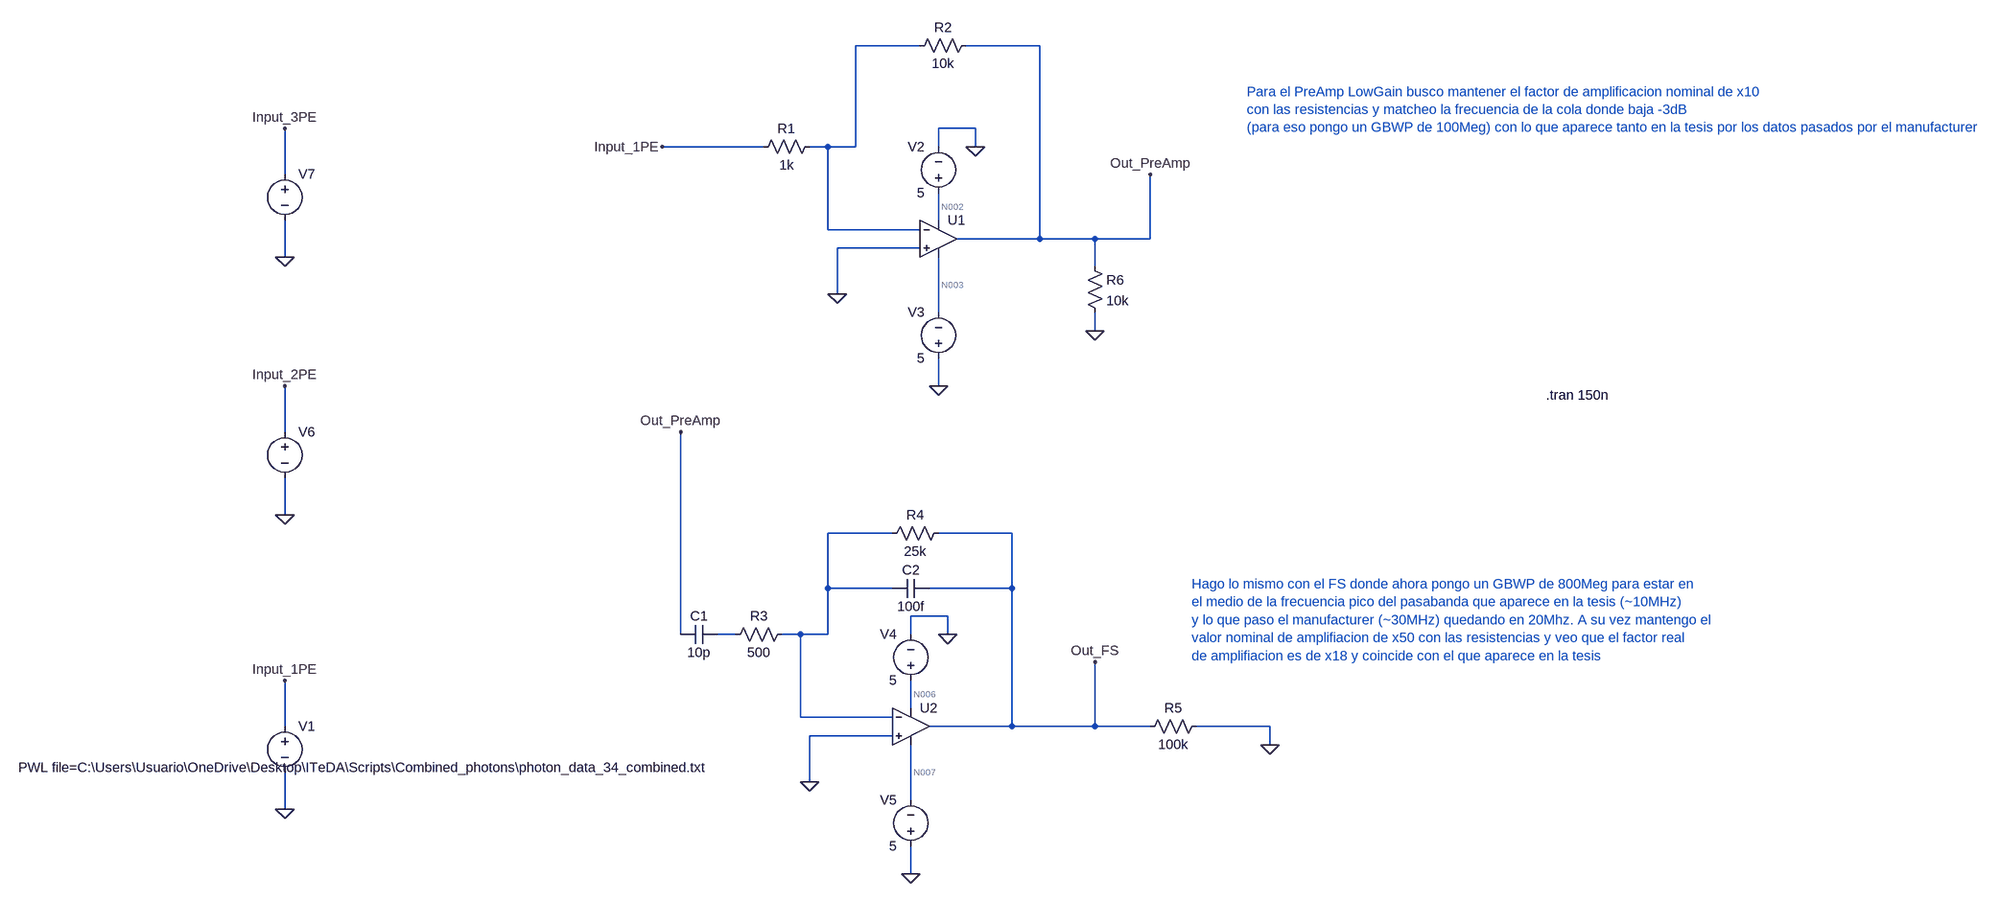
[diagram p0: schematic full_electronic_v4_con_comentariso_ajustadocondata.asc]
full_electronic_v4_con_comentariso_ajustadocondata.asc, the LTspice schematic file:
Version 4
SHEET 1 2316 820
WIRE 144 -800 32 -800
WIRE 352 -800 224 -800
WIRE 240 -656 176 -656
WIRE -128 -624 -304 -624
WIRE -16 -624 -48 -624
WIRE 32 -624 32 -800
WIRE 32 -624 -16 -624
WIRE 176 -624 176 -656
WIRE 240 -624 240 -656
WIRE -960 -576 -960 -656
WIRE 176 -496 176 -544
WIRE -16 -480 -16 -624
WIRE 144 -480 -16 -480
WIRE 352 -464 352 -800
WIRE 352 -464 208 -464
WIRE 448 -464 352 -464
WIRE 544 -464 544 -576
WIRE 544 -464 448 -464
WIRE 144 -448 0 -448
WIRE -960 -432 -960 -496
WIRE 448 -416 448 -464
WIRE 0 -368 0 -448
WIRE 176 -336 176 -432
WIRE 448 -304 448 -336
WIRE 176 -208 176 -256
WIRE -960 -128 -960 -208
WIRE -960 16 -960 -48
WIRE 96 48 -16 48
WIRE 304 48 176 48
WIRE -16 144 -16 48
WIRE 96 144 -16 144
WIRE 304 144 304 48
WIRE 304 144 160 144
WIRE 192 192 128 192
WIRE -272 224 -272 -128
WIRE -176 224 -208 224
WIRE -64 224 -96 224
WIRE -16 224 -16 144
WIRE -16 224 -64 224
WIRE 128 224 128 192
WIRE 192 224 192 192
WIRE 128 352 128 304
WIRE -64 368 -64 224
WIRE 96 368 -64 368
WIRE -960 384 -960 304
WIRE 304 384 304 144
WIRE 304 384 160 384
WIRE 448 384 448 272
WIRE 448 384 304 384
WIRE 544 384 448 384
WIRE 752 384 624 384
WIRE 96 400 -48 400
WIRE 752 416 752 384
WIRE -48 480 -48 400
WIRE 128 512 128 416
WIRE -960 528 -960 464
WIRE 128 640 128 592
FLAG 176 -208 0
FLAG 240 -624 0
FLAG -960 528 0
FLAG 0 -368 0
FLAG 128 640 0
FLAG 192 224 0
FLAG -48 480 0
FLAG 544 -576 Out_PreAmp
FLAG 448 272 Out_FS
FLAG 752 416 0
FLAG -272 -128 Out_PreAmp
FLAG -960 304 Input_1PE
FLAG -960 16 0
FLAG -960 -208 Input_2PE
FLAG -304 -624 Input_1PE
FLAG 448 -304 0
FLAG -960 -432 0
FLAG -960 -656 Input_3PE
SYMBOL res -32 -640 R90
WINDOW 0 0 56 VBottom 2
WINDOW 3 32 56 VTop 2
SYMATTR InstName R1
SYMATTR Value 1k
SYMBOL res 240 -816 R90
WINDOW 0 0 56 VBottom 2
WINDOW 3 32 56 VTop 2
SYMATTR InstName R2
SYMATTR Value 10k
SYMBOL voltage 176 -528 R180
WINDOW 0 24 96 Left 2
WINDOW 3 24 16 Left 2
WINDOW 123 0 0 Left 0
WINDOW 39 0 0 Left 0
SYMATTR InstName V2
SYMATTR Value 5
SYMBOL voltage 176 -240 R180
WINDOW 0 24 96 Left 2
WINDOW 3 24 16 Left 2
WINDOW 123 0 0 Left 0
WINDOW 39 0 0 Left 0
SYMATTR InstName V3
SYMATTR Value 5
SYMBOL OpAmps\\UniversalOpAmp1 176 -464 R0
SYMATTR InstName U1
SYMATTR Value2 Avol=1Meg GBW=100Meg Vos=0
SYMBOL res -80 208 R90
WINDOW 0 0 56 VBottom 2
WINDOW 3 32 56 VTop 2
SYMATTR InstName R3
SYMATTR Value 500
SYMBOL res 192 32 R90
WINDOW 0 0 56 VBottom 2
WINDOW 3 32 56 VTop 2
SYMATTR InstName R4
SYMATTR Value 25k
SYMBOL voltage 128 320 R180
WINDOW 0 24 96 Left 2
WINDOW 3 24 16 Left 2
WINDOW 123 0 0 Left 0
WINDOW 39 0 0 Left 0
SYMATTR InstName V4
SYMATTR Value 5
SYMBOL voltage 128 608 R180
WINDOW 0 24 96 Left 2
WINDOW 3 24 16 Left 2
WINDOW 123 0 0 Left 0
WINDOW 39 0 0 Left 0
SYMATTR InstName V5
SYMATTR Value 5
SYMBOL OpAmps\\UniversalOpAmp1 128 384 R0
SYMATTR InstName U2
SYMATTR Value2 Avol=1Meg GBW=800Meg Vos=0
SYMBOL voltage -960 368 R0
WINDOW 3 -463 87 Left 2
WINDOW 123 0 0 Left 0
WINDOW 39 0 0 Left 0
SYMATTR Value PWL file=C:\Users\Usuario\OneDrive\Desktop\ITeDA\Scripts\Combined_photons\photon_data_34_combined.txt
SYMATTR InstName V1
SYMBOL res 640 368 R90
WINDOW 0 0 56 VBottom 2
WINDOW 3 32 56 VTop 2
SYMATTR InstName R5
SYMATTR Value 100k
SYMBOL cap -208 208 R90
WINDOW 0 0 32 VBottom 2
WINDOW 3 32 32 VTop 2
SYMATTR InstName C1
SYMATTR Value 10p
SYMBOL cap 160 128 R90
WINDOW 0 0 32 VBottom 2
WINDOW 3 32 32 VTop 2
SYMATTR InstName C2
SYMATTR Value 100f
SYMBOL voltage -960 -144 R0
WINDOW 3 -463 87 Left 2
WINDOW 123 0 0 Left 0
WINDOW 39 0 0 Left 0
SYMATTR Value ""
SYMATTR InstName V6
SYMBOL res 432 -432 R0
SYMATTR InstName R6
SYMATTR Value 10k
SYMBOL voltage -960 -592 R0
WINDOW 3 -463 87 Left 2
WINDOW 123 0 0 Left 0
WINDOW 39 0 0 Left 0
SYMATTR Value ""
SYMATTR InstName V7
TEXT 1232 -192 Left 2 !.tran 150n
TEXT 712 -720 Left 2 ;Para el PreAmp LowGain busco mantener el factor de amplificacion nominal de x10 \ncon las resistencias y matcheo la frecuencia de la cola donde baja -3dB \n(para eso pongo un GBWP de 100Meg) con lo que aparece tanto en la tesis por los datos pasados por el manufacturer
TEXT 616 136 Left 2 ;Hago lo mismo con el FS donde ahora pongo un GBWP de 800Meg para estar en \nel medio de la frecuencia pico del pasabanda que aparece en la tesis (~10MHz)\ny lo que paso el manufacturer (~30MHz) quedando en 20Mhz. A su vez mantengo el \nvalor nominal de amplifiacion de x50 con las resistencias y veo que el factor real\nde amplifiacion es de x18 y coincide con el que aparece en la tesis

The netlist it stands for:
* full_electronic_v4_con_comentariso_ajustadocondata.asc
R1 N001 Input_1PE 1k
R2 Out_PreAmp N001 10k
V2 N002 0 5
V3 0 N003 5
XU1 0 N001 N002 N003 Out_PreAmp level1 Avol=1Meg GBW=100Meg Vos=0 En=0 Enk=0 In=0 Ink=0 Rin=500Meg  ; pins In+ In- V+ V- OUT
R3 N004 N005 500
R4 Out_FS N004 25k
V4 N006 0 5
V5 0 N007 5
XU2 0 N004 N006 N007 Out_FS level1 Avol=1Meg GBW=800Meg Vos=0 En=0 Enk=0 In=0 Ink=0 Rin=500Meg  ; pins In+ In- V+ V- OUT
V1 Input_1PE 0 PWL file=C:\Users\Usuario\OneDrive\Desktop\ITeDA\Scripts\Combined_photons\photon_data_34_combined.txt
R5 0 Out_FS 100k
C1 N005 Out_PreAmp 10p
C2 Out_FS N004 100f
V6 Input_2PE 0
R6 Out_PreAmp 0 10k
V7 Input_3PE 0
.tran 150n
* Para el PreAmp LowGain busco mantener el factor de amplificacion nominal de x10
* con las resistencias y matcheo la frecuencia de la cola donde baja -3dB
* (para eso pongo un GBWP de 100Meg) con lo que aparece tanto en la tesis por los datos pasados por el manufacturer
* Hago lo mismo con el FS donde ahora pongo un GBWP de 800Meg para estar en
* el medio de la frecuencia pico del pasabanda que aparece en la tesis (~10MHz)
* y lo que paso el manufacturer (~30MHz) quedando en 20Mhz. A su vez mantengo el
* valor nominal de amplifiacion de x50 con las resistencias y veo que el factor real
* de amplifiacion es de x18 y coincide con el que aparece en la tesis
.lib UniversalOpAmp1.lib
.backanno
.end

* Results of the author's LTspice run, read from the files saved beside the schematic
* Operating Point, zero values left out:
*   V(n002) = 5 V
*   V(n003) = -5 V
*   V(n006) = 5 V
*   V(n007) = -5 V
*   I(V2) = -10 nA
*   I(V3) = -10 nA
*   I(V4) = -10 nA
*   I(V5) = -10 nA
*   Ix(u1:3) = 10 nA
*   Ix(u1:4) = -10 nA
*   Ix(u2:3) = 10 nA
*   Ix(u2:4) = -10 nA
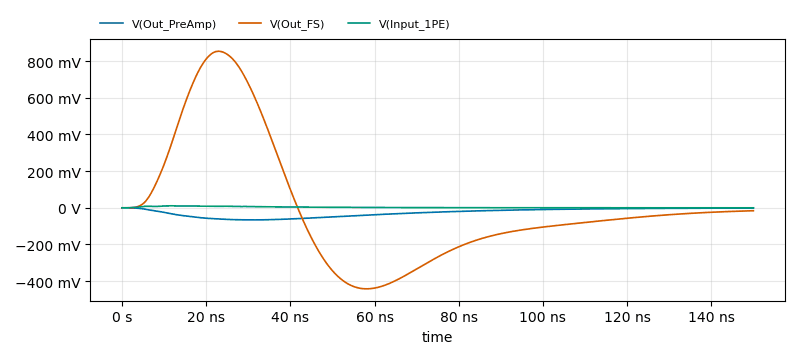
[diagram p1: Transient Analysis of full_electronic_v4_con_comentariso_ajustadocondata.asc, plotted from the saved traces]
* Transient Analysis, 1 run:
*   V(Out_PreAmp): min -66.02 mV, max 0 V, average -25.38 mV, rms 33.88 mV, last -1.229 mV
*   V(Out_FS): min -441.8 mV, max 853.8 mV, average 2.588 mV, rms 335.8 mV, last -15.86 mV
*   V(Input_1PE): min 0 V, max 11.12 mV, average 2.552 mV, rms 4.097 mV, last 32.63 µV